# EAGLE design Zio Qwiic IO Expander (EAGLE 8.4.1)
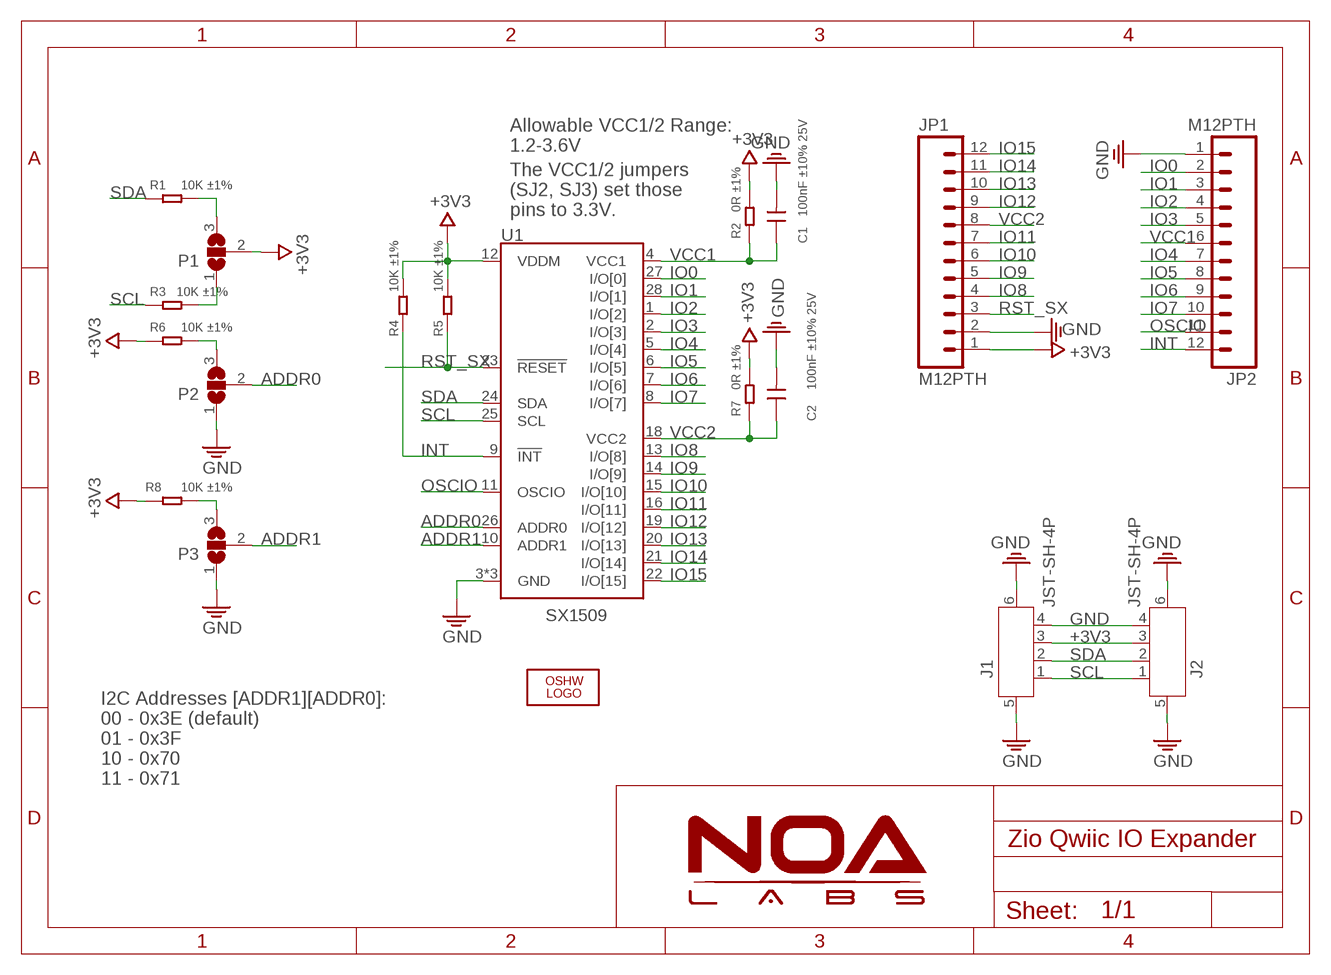
[diagram p0: schematic, sheet 1]

## Parts
C1  100nF ±10% 25V  C-0402  [0402]
C2  100nF ±10% 25V  C-0402  [0402]
J1  JST-SH-4P  [JST-SH-4P-90]
J2  JST-SH-4P  [JST-SH-4P-90]
JP1  M12PTH  [1X12]
JP2  M12PTH  [1X12]
LOGO  LOGO-OSHW-6MILX0100-NT  [OSHW_6X100_NOTEXT]
P1  PAD-SOLDERJUMPER-2WAY  [3P-SMD-1.78X1.27]
P2  PAD-SOLDERJUMPER-2WAY  [3P-SMD-1.78X1.27]
P3  PAD-SOLDERJUMPER-2WAY  [3P-SMD-1.78X1.27]
R1  10K ±1%  R-0402  [0402]
R2  0R ±1%  R-0402  [0402]
R3  10K ±1%  R-0402  [0402]
R4  10K ±1%  R-0402  [0402]
R5  10K ±1%  R-0402  [0402]
R6  10K ±1%  R-0402  [0402]
R7  0R ±1%  R-0402  [0402]
R8  10K ±1%  R-0402  [0402]
U1  SX1509  [QFN-28]

## Nets
+3V3: J1.3 J2.3 JP1.1 P1.2 R2.2 R4.2 R5.2 R6.1 R7.2 R8.1 U1.12(VDDM)
ADDR0: P2.2 U1.26(ADDR0)
ADDR1: P3.2 U1.10(ADDR1)
GND: C1.2 C2.2 J1.4 J1.5 J1.6 J2.4 J2.5 J2.6 JP1.2 JP2.1 P2.1 P3.1 U1.3(GND) U1.17(GND) U1.29(GND)
INT: JP2.12 R4.1 U1.9(!INT)
IO0: JP2.2 U1.27(I/O[0])
IO1: JP2.3 U1.28(I/O[1])
IO2: JP2.4 U1.1(I/O[2])
IO3: JP2.5 U1.2(I/O[3])
IO4: JP2.7 U1.5(I/O[4])
IO5: JP2.8 U1.6(I/O[5])
IO6: JP2.9 U1.7(I/O[6])
IO7: JP2.10 U1.8(I/O[7])
IO8: JP1.4 U1.13(I/O[8])
IO9: JP1.5 U1.14(I/O[9])
IO10: JP1.6 U1.15(I/O[10])
IO11: JP1.7 U1.16(I/O[11])
IO12: JP1.9 U1.19(I/O[12])
IO13: JP1.10 U1.20(I/O[13])
IO14: JP1.11 U1.21(I/O[14])
IO15: JP1.12 U1.22(I/O[15])
N$1: P1.3 R1.2
N$2: P1.1 R3.2
N$3: P2.3 R6.2
N$5: P3.3 R8.2
OSCIO: JP2.11 U1.11(OSCIO)
RST_SX: JP1.3 R5.1 U1.23(!RESET)
SCL: J1.1 J2.1 R3.1 U1.25(SCL)
SDA: J1.2 J2.2 R1.1 U1.24(SDA)
VCC1: C1.1 JP2.6 R2.1 U1.4(VCC1)
VCC2: C2.1 JP1.8 R7.1 U1.18(VCC2)

## Notes on the sheet
- Allowable VCC1/2 Range: 
  1.2-3.6V
- The VCC1/2 jumpers 
  (SJ2, SJ3) set those 
  pins to 3.3V.
- I2C Addresses [ADDR1][ADDR0]:
  00 - 0x3E (default)
  01 - 0x3F
  10 - 0x70
  11 - 0x71

## Library data of the parts
C1 C2 = Discrete:C*: Ceramic Capacitors
J1 J2 = Connector:JST-SH-4P
JP1 JP2 = IO_Expander_SX1509_arduino_shield:M12: Header 12 Standard 12-pin 0.1" header. Use with straight break away headers (SKU : PRT-00116), right angle break away headers (PRT-00553), swiss pins (PRT-00743), machine pins (PRT-00117), and female headers (PRT-00115).
LOGO = Logo:LOGO-OSHW-6MIL
P1-P3 = Discrete:PAD-SOLDERJUMPER-2WAY: Solder Jumper 2 way solder jumper
R1-R8 = Discrete:R*
U1 = IC:SX1509: Semtech SX1509 The SX1509 is a complete ultra low voltage 1.2V to 3.6V General Purpose parallel Input/Output (GPIO) expanders ideal for low power handheld battery powered equipment. This version comes in a 16-channel configuration and allows easy serial expansion of I/O through a standard 400kHz I2C interface. GPIO devices can provide additional control and monitoring when the microcontroller or chipset has insufficient I/O ports, or in systems where serial communication and control from a remote location is advantageous.; PROD_ID: IC-11311

## Net classes
0 default: width 0.178 mm
1 vcc: width 0.254 mm

## Board
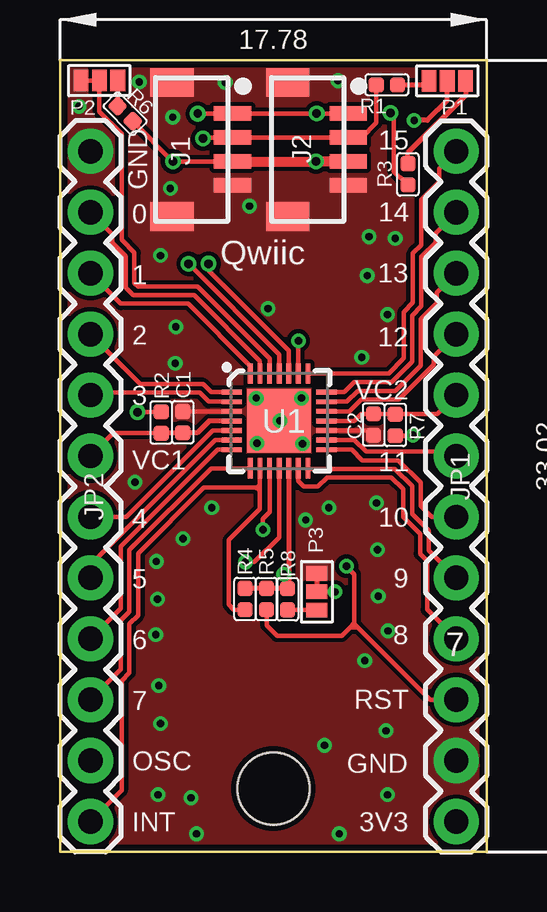
[diagram p1: board, top side]
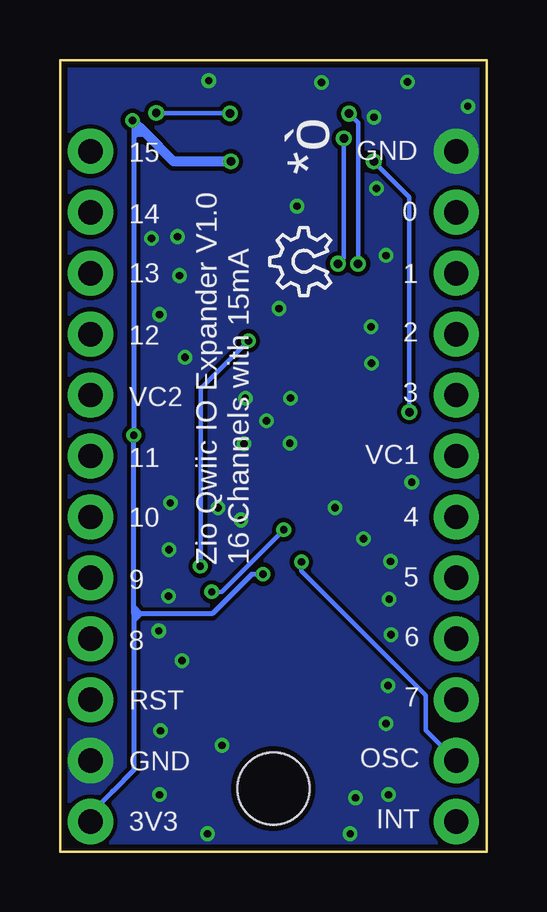
[diagram p2: board, bottom side, seen from below]

Size 17.78 x 33.02 mm. Coordinates in mm from the lower left corner, seen from the top.
Outline: 17.78,33.02 0,33.02 0,0 17.78,0 17.78,33.02
Copper layers (1*16): Top 0.035mm / dielectric 1.5mm / Bottom 0.035mm
Design rules "NOA Eagle Rule *": minimum track width 6mil, minimum drill 12mil, track to track 7mil, track to pad 7mil, pad to pad 7mil, via to via 7mil, smd to smd 0mil, copper to edge 10mil, drill to drill 10mil, minimum pad ring 10mil, minimum via ring 6mil, stop-mask expansion 2mil, vias tented up to drill 25mil, thermal gap 10mil
Holes 3 mm at 8.89,2.64
tRestrict: 3 lines

### Footprints (pad centres in the part's own frame; a part is rotated, then mirrored left to right if it is on the bottom)
0402 = smd 0.635 x 0.635: 1 -0.445,0; 2 0.445,0
JST-SH-4P-90 = smd 0.6 x 1.55: 1 1.5,0; 2 0.5,0; 3 -0.5,0; 4 -1.5,0 | smd 1.2 x 1.8: 5 -2.8,2.525; 6 2.8,2.525
1X12 = drill 1.016 pad 1.88: 1 0,0; 2 2.54,0; 3 5.08,0; 4 7.62,0; 5 10.16,0; 6 12.7,0; 7 15.24,0; 8 17.78,0; 9 20.32,0; 10 22.86,0; 11 25.4,0; 12 27.94,0
3P-SMD-1.78X1.27 = smd 0.889 x 0.61: 1 0,0.762; 2 0,0; 3 0,-0.762
QFN-28 = smd 0.85 x 0.2: 1 -1.975,1.2; 2 -1.975,0.8; 3 -1.975,0.4; 4 -1.975,0; 5 -1.975,-0.4; 6 -1.975,-0.8; 7 -1.975,-1.2; 15 1.975,-1.2; 16 1.975,-0.8; 17 1.975,-0.4; 18 1.975,0; 19 1.975,0.4; 20 1.975,0.8; 21 1.975,1.2 | smd 0.2 x 0.85: 8 -1.2,-1.975; 9 -0.8,-1.975; 10 -0.4,-1.975; 11 0,-1.975; 12 0.4,-1.975; 13 0.8,-1.975; 14 1.2,-1.975; 22 1.2,1.975; 23 0.8,1.975; 24 0.4,1.975; 25 0,1.975; 26 -0.4,1.975; 27 -0.8,1.975; 28 -1.2,1.975 | smd 2.65 x 2.65: 29 0,0

### Placement (x,y rotation side)
C1  5.12,17.92 90 top
C2  13.07,17.82 270 top
E$3  [6MM]  8.84,9.6 90 bottom
J1  7.19,29.29 90 top
J2  12.01,29.29 90 top
JP1  16.51,1.27 90 top
JP2  1.27,29.21 270 top
LOGO  6.5,23.21 90 bottom
P1  16.14,32.15 270 top
P2  1.64,32.16 90 top
P3  10.7,10.85 0 top
R1  13.62,31.98 0 top
R2  4.22,17.91 90 top
R3  14.5,28.25 90 top
R4  7.72,10.55 90 top
R5  8.6,10.55 90 top
R6  2.71,30.78 135 top
R7  13.97,17.81 270 top
R8  9.48,10.54 270 top
U1  9.13,17.97 0 top
U$7  [6MM]  7.06,5.13 0 top

### Tracks (layer width: path | path; a pad name or v marks a point on that pad's centre or on a via)
+3V3  (via drill 0.3, 0.35)
  Top 0.178: J1.3 v4.71,28.79 R6.1 | R2.2 3.24,18.35 v3.23,18.34
  Top 0.203: U1.12 9.53,11.58 | 9.53,11.58 9.53,10.98 R8.1 R5.2 R4.2 | 9.53,11.58 v9.32,11.58 | R7.2 13.98,17.37 v14.71,17.37 | P1.2 16.14,31.33 15.31,30.5 v14.76,30.5
  Top 0.406: J1.3 v10.66,28.79 J2.3
  Bottom 0.178: 15.59,2.54 16.51,1.62 JP1.1 | v3.23,18.34 3.23,27.31 v4.71,28.79
  Bottom 0.203: v9.32,11.58 9.79,11.58 11.44,9.93 14.71,9.93 | 14.71,9.93 14.71,10.21 | 14.71,10.21 v14.71,17.37 14.71,29.79 | 14.71,9.93 14.71,9.65 | 14.71,9.65 14.71,3.42 15.59,2.54 | 14.71,10.21 14.43,9.93 14.71,9.65 | 14.71,29.92 14.71,30.45 v14.76,30.5 | 14.71,29.92 14.71,29.79 | 14.58,29.92 14.71,29.92 | 14.58,29.92 14.34,29.92 14.25,30 | 14.71,29.79 14.7,29.79 14.58,29.92
  Bottom 0.406: v10.66,28.79 13.04,28.79 14.25,30 14.71,30.45
ADDR0
  Top 0.178: U1.26 8.73,20.57 5.74,23.57 3.25,23.57 3.1,23.72 3.1,24.99 2.56,25.52 2.56,29.95 1.65,30.87 P2.2
ADDR1  (via drill 0.3)
  Top 0.178: U1.10 8.73,14.17 8.46,13.89 v8.46,13.44 | v11.46,10.85 arc90 v11.45,10.85 P3.2
  Bottom 0.178: v8.46,13.44 11.05,10.85 v11.46,10.85
GND  (via drill 0.3)
  Top 0.178: U1.3 5.13,18.37 C1.2 | U1.17 12.87,17.57 C2.2
  other vias: 11.2,14.35 13.18,14.55 13.23,12.6 13.26,10.67 9.17,17.98 8.18,18.92 10.06,18.92 10.11,17.02 8.2,17.04 0.79,31.09 3.3,32.11 6.88,32.08 11.58,32.16 4.7,30.63 4.6,27.66 4.19,24.87 7.9,26.92 12.88,25.65 13.97,25.58 13.64,22.4 12.57,20.62 8.66,22.66 12.8,24.03 6.32,14.35 5.13,13.06 4.01,12.12 4.06,10.54 3.99,9.07 10.24,13.84 4.11,6.93 4.19,5.36 4.09,2.39 5.69,0.76 11.63,0.76 13.64,2.39 13.59,5.05 12.7,7.98 5.46,2.26 11.02,4.45 13.67,9.22 4.83,21.89 4.8,20.37 3.12,15.42
  pour Top (no thermals): 0,33.02 0,0 17.78,0 17.78,33.02
  pour Bottom (no thermals): 17.78,33.02 17.78,0 0,0 0,33.02
INT
  Top 0.178: U1.9 8.33,15.19 | 8.33,15.19 8.33,14.3 7.04,13.01 7.04,10.31 7.25,10.1 R4.1 | 8.33,15.19 8.13,15.19 | JP2.12 2.56,2.56 2.56,7.14 2.9,7.47 2.9,9.51 3.25,9.87 3.25,12.44 6,15.19 8.1,15.19 8.13,15.19 | 8.13,15.19 arc90 8.33,15.39 | 8.13,15.19 arc-90 8.33,14.99
IO0
  Top 0.178: U1.27 8.33,20.47 5.59,23.22 3.05,23.22 2.74,23.52 2.74,24.84 2.18,25.4 2.18,25.76 JP2.2
IO1
  Top 0.178: U1.28 7.93,20.26 5.33,22.86 2.54,22.86 JP2.3
IO2
  Top 0.178: U1.1 6.3,19.17 5.96,19.51 3.35,19.51 JP2.4
IO3
  Top 0.178: U1.2 6.2,18.77 5.82,19.15 1.37,19.15 JP2.5
IO4
  Top 0.178: U1.5 6.37,17.57 2.77,13.97 JP2.7
IO5
  Top 0.178: U1.6 6.47,17.17 1.27,11.97 JP2.8
IO6
  Top 0.178: U1.7 6.58,16.77 2.54,12.74 2.54,10.16 JP2.9
IO7
  Top 0.178: U1.8 6.3,16 2.9,12.59 2.9,10.01 2.54,9.66 2.54,7.62 JP2.10
IO8
  Top 0.178: U1.13 9.93,15.47 10.16,15.24 10.74,15.24 11.12,15.62 13.81,15.62 14.29,15.13 14.29,13.98 15.01,13.26 15.01,12.43 15.29,12.14 15.29,10.11 JP1.4
IO9
  Top 0.178: U1.14 10.35,15.98 13.96,15.98 14.68,15.25 14.68,14.09 15.37,13.41 15.37,12.57 JP1.5
IO10
  Top 0.178: U1.15 12.16,16.77 12.6,16.33 14.1,16.33 15.04,15.4 15.04,14.43 15.49,13.97 JP1.6
IO11
  Top 0.178: U1.16 12.27,17.17 12.75,16.69 16.33,16.69 JP1.7
IO12
  Top 0.178: U1.19 12.05,18.37 12.55,18.87 14.12,18.87 15.57,20.32 15.57,20.65 JP1.9
IO13
  Top 0.178: U1.20 11.94,18.77 12.4,19.23 13.97,19.23 15.04,20.29 15.04,22.23 15.7,22.89 15.7,23.32 JP1.10
IO14
  Top 0.178: U1.21 11.84,19.17 12.25,19.58 13.83,19.58 14.68,20.44 14.68,22.37 15.06,22.75 15.06,24.82 15.65,25.4 15.65,25.81 JP1.11
IO15
  Top 0.178: U1.22 13.69,19.95 14.33,20.58 14.33,22.52 14.71,22.9 14.71,24.96 15.05,25.31 15.05,27.19 15.8,27.94 15.8,28.5 JP1.12
N$1
  Top 0.203: R1.2 15.21,31.98 P1.3
N$2
  Top 0.203: R3.2 14.5,29.15 16.9,31.55 P1.1
N$3
  Top 0.178: P2.3 2.4,32.15 R6.2
N$4
  Top 0.178: 0.96,32.16 1.63,32.16
N$5
  Top 0.178: R8.2 P3.3
N$8
  Top 0.203: 10.72,10.9 10.72,11.56
OSCIO  (via drill 0.3)
  Top 0.178: U1.11 9.13,13.12 8.1,12.09 v7.72,12.09
  Bottom 0.178: JP2.11 2.54,5.08 2.54,6.53 7.72,11.71 v7.72,12.09
RST_SX  (via drill 0.3)
  Top 0.178: R5.1 8.6,9.46 9.04,9.02 11.73,9.02 12.09,9.37 | U1.23 v9.93,21.31 | v11.94,11.91 12.27,11.58 12.27,9.55 12.25,9.53 | 12.25,9.53 12.09,9.37 | JP1.3 15.43,6.35 12.25,9.53 | 12.09,9.37 12.39,9.37
  Bottom 0.178: v9.93,21.31 11.91,19.33 11.91,11.91 v11.94,11.91
SCL  (via drill 0.35)
  Top 0.178: J2.1 v10.7,30.79 J1.1 v5.74,30.79 | R3.1 14.19,28.11 14.16,28.11 13.91,28.36 13.91,30.67 v13.77,30.81 | v5.36,24.52 9.13,20.75 U1.25
  Bottom 0.178: v13.77,30.81 10.72,30.81 v10.7,30.79 | v5.36,24.52 5.36,30.4 v5.74,30.79
SDA  (via drill 0.35)
  Top 0.178: R1.1 13.18,30.4 12.56,29.79 J2.2 J1.2 6,29.79 v5.95,29.74 | U1.24 9.53,20.9 6.19,24.24 v6.19,24.53
  Bottom 0.178: v5.95,29.74 5.95,24.77 v6.19,24.53
VCC1
  Top 0.178: R2.1 2.22,17.46 JP2.6
  Top 0.203: U1.4 6.21,17.97 5.71,17.48 C1.1 4.23,17.47 R2.1
VCC2
  Top 0.178: U1.18 12.26,17.97 12.55,18.26 C2.1 13.96,18.26 R7.1 15.71,18.25 JP1.8

### Text on the board
tPlace: 15 | GND | 14 | 0 | 13 | 1 | Qwiic | 12 | 2 | VC2 | 3 | 11 | VC1 | 4 | 10 | 9 | 5 | 8 | 6 | 7 | RST | 7 | GND | OSC | 3V3 | INT
bPlace: *ò | GND | 15 | 0 | 14 | 1 | 13 | 2 | 12 | 3 | VC2 | VC1 | 11 | 4 | 10 | 5 | Zio Qwiic IO Expander V1.0 / 16 Channels with 15mA | 9 | 6 | 8 | 7 | RST | OSC | GND | INT | 3V3